# Altium schematic sheet KSZ_Switch_Control.SchDoc
size A4; DrawnBy: Emile Renaud; Revision: V1.0; SheetNumber: 6; SheetTotal: 8
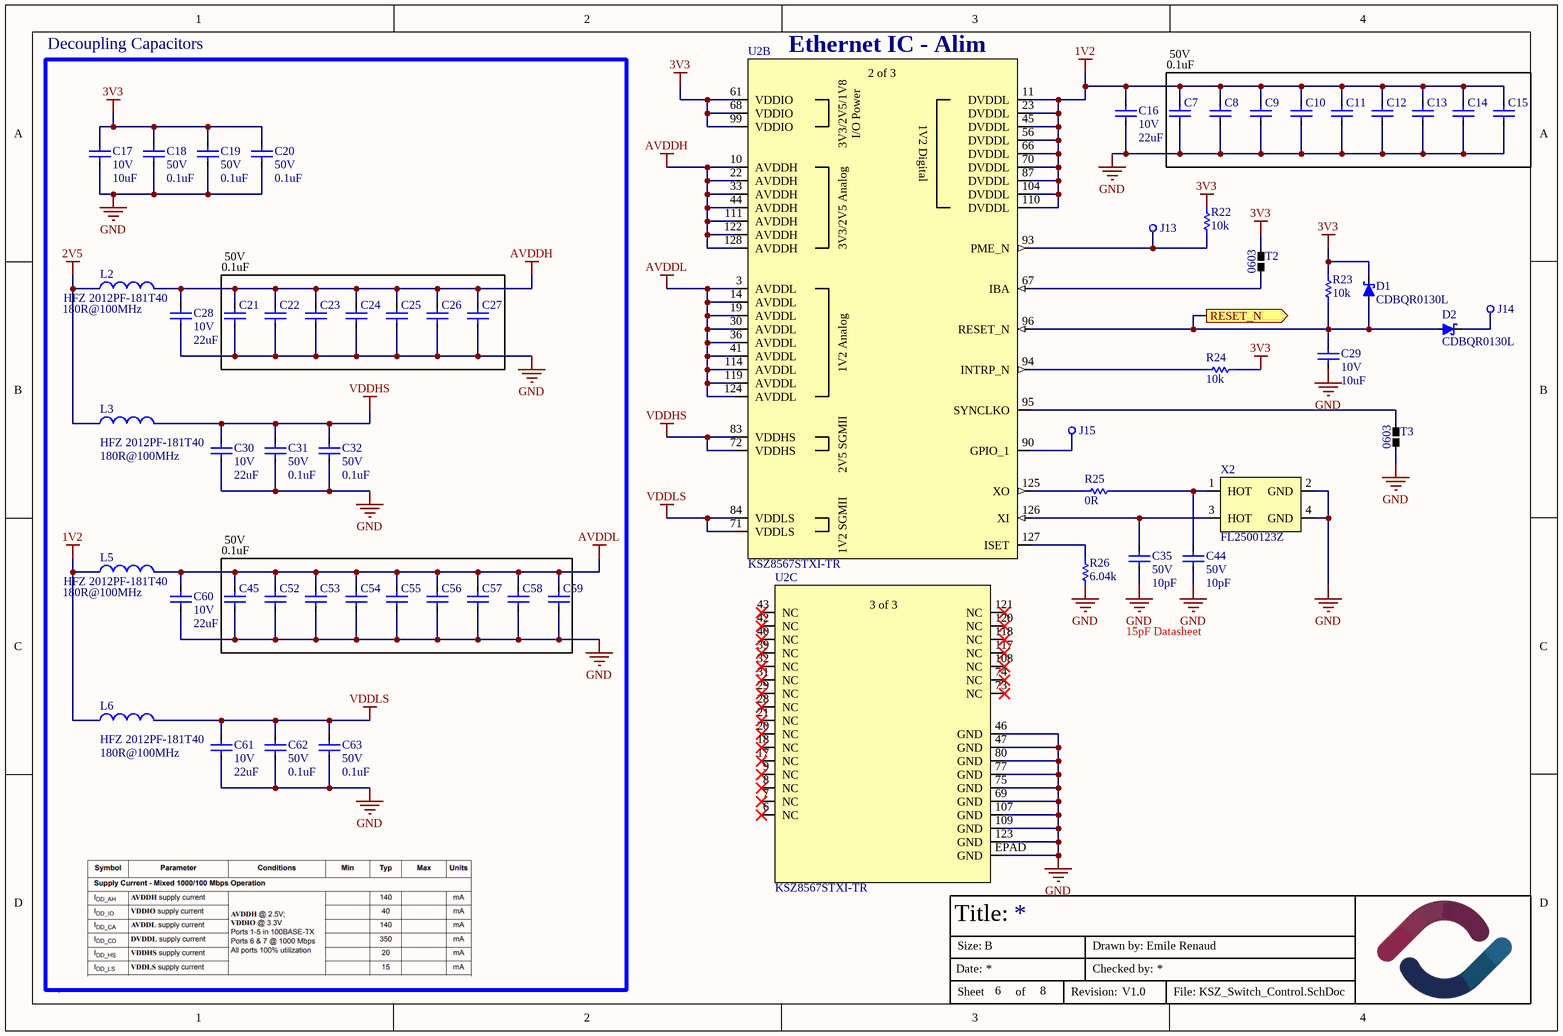
[diagram p0: KSZ_Switch_Control.SchDoc]

## Parts
C7  Capacitor-0603-0.1uF-50V-X7R  [CAPACITOR-0603]  (value not drawn)
C8  Capacitor-0603-0.1uF-50V-X7R  [CAPACITOR-0603]  (value not drawn)
C9  Capacitor-0603-0.1uF-50V-X7R  [CAPACITOR-0603]  (value not drawn)
C10  Capacitor-0603-0.1uF-50V-X7R  [CAPACITOR-0603]  (value not drawn)
C11  Capacitor-0603-0.1uF-50V-X7R  [CAPACITOR-0603]  (value not drawn)
C12  Capacitor-0603-0.1uF-50V-X7R  [CAPACITOR-0603]  (value not drawn)
C13  Capacitor-0603-0.1uF-50V-X7R  [CAPACITOR-0603]  (value not drawn)
C14  Capacitor-0603-0.1uF-50V-X7R  [CAPACITOR-0603]  (value not drawn)
C15  Capacitor-0603-0.1uF-50V-X7R  [CAPACITOR-0603]  (value not drawn)
C16  value 22uF  Volt: 10V  [CAPACITOR-0603]  (hidden comment: Capacitor-0603-22uF-10V-X5R)
C17  value 10uF  Volt: 10V  [CAPACITOR-0603]  (hidden comment: Capacitor-0603-10uF-10V-X5R)
C18  value 0.1uF  Volt: 50V  [CAPACITOR-0603]  (hidden comment: Capacitor-0603-0.1uF-50V-X7R)
C19  value 0.1uF  Volt: 50V  [CAPACITOR-0603]  (hidden comment: Capacitor-0603-0.1uF-50V-X7R)
C20  value 0.1uF  Volt: 50V  [CAPACITOR-0603]  (hidden comment: Capacitor-0603-0.1uF-50V-X7R)
C21  Capacitor-0603-0.1uF-50V-X7R  [CAPACITOR-0603]  (value not drawn)
C22  Capacitor-0603-0.1uF-50V-X7R  [CAPACITOR-0603]  (value not drawn)
C23  Capacitor-0603-0.1uF-50V-X7R  [CAPACITOR-0603]  (value not drawn)
C24  Capacitor-0603-0.1uF-50V-X7R  [CAPACITOR-0603]  (value not drawn)
C25  Capacitor-0603-0.1uF-50V-X7R  [CAPACITOR-0603]  (value not drawn)
C26  Capacitor-0603-0.1uF-50V-X7R  [CAPACITOR-0603]  (value not drawn)
C27  Capacitor-0603-0.1uF-50V-X7R  [CAPACITOR-0603]  (value not drawn)
C28  value 22uF  Volt: 10V  [CAPACITOR-0603]  (hidden comment: Capacitor-0603-22uF-10V-X5R)
C29  value 10uF  Volt: 10V  [CAPACITOR-0603]  (hidden comment: Capacitor-0603-10uF-10V-X5R)
C30  value 22uF  Volt: 10V  [CAPACITOR-0603]  (hidden comment: Capacitor-0603-22uF-10V-X5R)
C31  value 0.1uF  Volt: 50V  [CAPACITOR-0603]  (hidden comment: Capacitor-0603-0.1uF-50V-X7R)
C32  value 0.1uF  Volt: 50V  [CAPACITOR-0603]  (hidden comment: Capacitor-0603-0.1uF-50V-X7R)
C35  value 10pF  Volt: 50V  [CAPACITOR-0402]  (hidden comment: Capacitor-0402-10pF-50V-C0G)
C44  value 10pF  Volt: 50V  [CAPACITOR-0402]  (hidden comment: Capacitor-0402-10pF-50V-C0G)
C45  Capacitor-0603-0.1uF-50V-X7R  [CAPACITOR-0603]  (value not drawn)
C52  Capacitor-0603-0.1uF-50V-X7R  [CAPACITOR-0603]  (value not drawn)
C53  Capacitor-0603-0.1uF-50V-X7R  [CAPACITOR-0603]  (value not drawn)
C54  Capacitor-0603-0.1uF-50V-X7R  [CAPACITOR-0603]  (value not drawn)
C55  Capacitor-0603-0.1uF-50V-X7R  [CAPACITOR-0603]  (value not drawn)
C56  Capacitor-0603-0.1uF-50V-X7R  [CAPACITOR-0603]  (value not drawn)
C57  Capacitor-0603-0.1uF-50V-X7R  [CAPACITOR-0603]  (value not drawn)
C58  Capacitor-0603-0.1uF-50V-X7R  [CAPACITOR-0603]  (value not drawn)
C59  Capacitor-0603-0.1uF-50V-X7R  [CAPACITOR-0603]  (value not drawn)
C60  value 22uF  Volt: 10V  [CAPACITOR-0603]  (hidden comment: Capacitor-0603-22uF-10V-X5R)
C61  value 22uF  Volt: 10V  [CAPACITOR-0603]  (hidden comment: Capacitor-0603-22uF-10V-X5R)
C62  value 0.1uF  Volt: 50V  [CAPACITOR-0603]  (hidden comment: Capacitor-0603-0.1uF-50V-X7R)
C63  value 0.1uF  Volt: 50V  [CAPACITOR-0603]  (hidden comment: Capacitor-0603-0.1uF-50V-X7R)
D1  CDBQR0130L  [Diode-0402]
D2  CDBQR0130L  [Diode-0402]
J13  hole  [PAD-0.53MM]  (value not drawn)  (no BOM)
J14  hole  [PAD-0.53MM]  (value not drawn)  (no BOM)
J15  hole  [PAD-0.53MM]  (value not drawn)  (no BOM)
L2  HFZ 2012PF-181T40  value 180R@100MHz  [CAPACITOR-0805]
L3  HFZ 2012PF-181T40  value 180R@100MHz  [CAPACITOR-0805]
L5  HFZ 2012PF-181T40  value 180R@100MHz  [CAPACITOR-0805]
L6  HFZ 2012PF-181T40  value 180R@100MHz  [CAPACITOR-0805]
R22  value 10k  [Resistor-0603]  (hidden comment: SMT resistor)
R23  value 10k  [Resistor-0603]  (hidden comment: SMT resistor)
R24  value 10k  [Resistor-0603]  (hidden comment: SMT resistor)
R25  value 0R  [Resistor-0402]  (hidden comment: SMT resistor)
R26  value 6.04k  [Resistor-0603]  (hidden comment: SMT resistor)
T2  NetTie_0603  [NetTie-0603-short]  (value not drawn)
T3  NetTie_0603_Short  [NetTie-0603-short]  (value not drawn)
U2  KSZ8567STXI-TR  [TQFP128_EP_6XX_MCH-M]  (parts B,C of 3)
X2  FL2500123Z  [4-SMD]

## Blocks framed on the sheet
Decoupling Capacitors: C17-C28 C30-C32 C45 C52-C63 L2 L3 L5 L6

## Ports
RESET_N (out)

## Nets
1V2: C7.2 C8.2 C9.2 C10.2 C11.2 C12.2 C13.2 C14.2 C15.2 C16.2 L5.1 L6.1 U2.11(DVDDL) U2.23(DVDDL) U2.45(DVDDL) U2.56(DVDDL) U2.66(DVDDL) U2.70(DVDDL) U2.87(DVDDL) U2.104(DVDDL) U2.110(DVDDL)
2V5: L2.1 L3.1
3V3: C17.2 C18.2 C19.2 C20.2 D1.2(K) R22.2 R23.2 R24.2 T2.1 U2.61(VDDIO) U2.68(VDDIO) U2.99(VDDIO)
AVDDH: C21.2 C22.2 C23.2 C24.2 C25.2 C26.2 C27.2 C28.2 L2.2 U2.10(AVDDH) U2.22(AVDDH) U2.33(AVDDH) U2.44(AVDDH) U2.111(AVDDH) U2.122(AVDDH) U2.128(AVDDH)
AVDDL: C45.2 C52.2 C53.2 C54.2 C55.2 C56.2 C57.2 C58.2 C59.2 C60.2 L5.2 U2.3(AVDDL) U2.14(AVDDL) U2.19(AVDDL) U2.30(AVDDL) U2.36(AVDDL) U2.41(AVDDL) U2.114(AVDDL) U2.119(AVDDL) U2.124(AVDDL)
GND: C7.1 C8.1 C9.1 C10.1 C11.1 C12.1 C13.1 C14.1 C15.1 C16.1 C17.1 C18.1 C19.1 C20.1 C21.1 C22.1 C23.1 C24.1 C25.1 C26.1 C27.1 C28.1 C29.1 C30.1 C31.1 C32.1 C35.1 C44.1 C45.1 C52.1 C53.1 C54.1 C55.1 C56.1 C57.1 C58.1 C59.1 C60.1 C61.1 C62.1 C63.1 R26.1 T3.2 U2.46(GND) U2.47(GND) U2.69(GND) U2.75(GND) U2.77(GND) U2.80(GND) U2.107(GND) U2.109(GND) U2.123(GND) U2.EPAD(GND) X2.2(GND) X2.4(GND)
VDDHS: C30.2 C31.2 C32.2 L3.2 U2.72(VDDHS) U2.83(VDDHS)
VDDLS: C61.2 C62.2 C63.2 L6.2 U2.71(VDDLS) U2.84(VDDLS)
RESET_N: C29.2 D1.1(A) D2.1(A) R23.1 U2.96(RESET_N) ; port RESET_N
NetC35_2: C35.2 U2.126(XI) X2.3(HOT)
NetC44_2: C44.2 R25.2 X2.1(HOT)
NetD2_2: D2.2(K) J14.1
NetJ13_1: J13.1 R22.1 U2.93(PME_N)
NetJ15_1: J15.1 U2.90(GPIO_1)
NetR24_1: R24.1 U2.94(INTRP_N)
NetR25_1: R25.1 U2.125(XO)
NetR26_2: R26.2 U2.127(ISET)
NetT2_2: T2.2 U2.67(IBA)
NetT3_1: T3.1 U2.95(SYNCLKO)

Not connected (* = marked no-connect by the designer): U2 6(NC)* 7(NC)* 8(NC)* 9(NC)* 17(NC)* 18(NC)* 20(NC)* 21(NC)* 28(NC)* 29(NC)* 31(NC)* 32(NC)* 39(NC)* 40(NC)* 42(NC)* 43(NC)* 73(NC)* 74(NC)* 108(NC)* 117(NC)* 118(NC)* 120(NC)* 121(NC)*

## Notes on the sheet
- (near U2) Ethernet IC - Alim
- 0.1uF
- 50V
- 15pF Datasheet
- Title:
- Date:
- Size:
- B
- Drawn by:
- Checked by:
- Sheet
- of
- Revision:
- File:
- (in symbol KSZ8567STXI-TR, part B) 2 of 3; 3V3/2V5/1V8; I/O Power; 1V2 Digital; 3V3/2V5 Analog; 1V2 Analog; 2V5 SGMII; 1V2 SGMII
- (in symbol KSZ8567STXI-TR, part C) 3 of 3
- (in symbol NetTie_0603_Short) 0603

## Library data of the parts
C7-C15 C21-C27 C45 C52-C59 = Capacitor-0603-0.1uF-50V-X7R: Precision: X7R-10%; Volt: 50V; Value: 0.1uF; Package / Case: Metric 1608, EIA 0603; Mounted: Yes; Supplier 1: Digi-Key; Supplier Part Number 1: 1276-1935-2-ND; Supplier 2: Digi-Key; Supplier Part Number 2: 1276-1934-2-ND
C16 C28 C30 C60 C61 = Capacitor-0603-22uF-10V-X5R: Precision: 20%; Supplier 1: Digikey; Supplier Part Number 1: 1276-1274-1-ND; Mounted: Yes; Package / Case: Metric 1608 , EIA 0603
C17 C29 = Capacitor-0603-10uF-10V-X5R: 10 µF ±20% 10V Ceramic Capacitor X5R 0603 (1608 Metric); Supplier 1: Digikey; Supplier Part Number 1: 4713-GMC10X5R106M10NTCT-ND; Mounted: Yes; Package / Case: Metric 1608 , EIA 0603; Precision: 20%
C18-C20 C31 C32 C62 C63 = Capacitor-0603-0.1uF-50V-X7R: Precision: X7R-10%; Package / Case: Metric 1608, EIA 0603; Mounted: Yes; Supplier 1: Digi-Key; Supplier Part Number 1: 1276-1935-2-ND; Supplier 2: Digi-Key; Supplier Part Number 2: 1276-1934-2-ND
C35 C44 = Capacitor-0402-10pF-50V-C0G: Precision: C0G - 10%; Package / Case: 0402 (1005 Metric); Mounted: Yes; Supplier 1: Digi-Key; Supplier Part Number 1: 399-C0402C100K5GAC7867CT-ND; Supplier 2: Digi-Key; HelpURL: https://connect.kemet.com:7667/gateway/IntelliData-ComponentDocumentation/1.0/download/datasheet/C0402C100K5GACTU
D1 D2 = CDBQR0130L: Diode SCHOTTKY  30 V 100mA Surface Mount 0402/SOD-923F; Volt: 30; Supplier 1: Digi-Key; Supplier Part Number 1: 641-1271-1-ND; Mounted: Yes; Package / Case: 0402/SOD-923F
J13-J15 = PAD 0.53mm AWG28-Solid: PAD for 28 AWG Solid Wire; Mounted: N/A
L2 L3 L5 L6 = HFZ 2012PF-181T40: 180 Ohms @ 100 MHz 1 Power Line Ferrite Bead 0805 (2012 Metric) 4A 20mOhm; Supplier 1: Digi-Key; Mounted: Yes; Supplier Part Number 1: 4816-HFZ2012PF-181T40CT-ND; Package / Case: SMD; Current: 4A
R22-R24 = Resistor-0603-10k: Resistor0603-10k; Precision: 1%; Watt: 0.1W; Mounted: Yes; Package / Case: Metric 1608, EIA 0603; Supplier 1: Digi-Key; Supplier Part Number 1: 311-10.0KHRTR-ND
R25 = Resistor-0402-0R: Precision: 1%; Watt: 1/16W; Mounted: Yes; Package / Case: Metric 1005, EIA 0402; Supplier 1: Digi-Key; Supplier Part Number 1: 311-100LRCT-ND
R26 = Resistor-0603-6.04k: Precision: 1%; Watt: 0.1W; Mounted: Yes; Package / Case: Metric 1608, EIA 0603; Supplier 1: Digi-Key; Supplier Part Number 1: 311-6.04KHRCT-ND
T2 = NetTie_0603_Short
U2 = KSZ8567STXI-TR: IC ETHERNET SWITCH 7PORT 128TQFP; Package / Case: 128TQFP; Mounted: Yes; Supplier 1: Digikey; Supplier Part Number 1: KSZ8567STXI-CT-ND; HelpURL: https://ww1.microchip.com/downloads/aemDocuments/documents/OTH/ProductDocuments/DataSheets/KSZ8567S-Data-Sheet-DS00002391C.pdf
X2 = FL2500123Z: 25 MHz ±30ppm Crystal 20pF 50 Ohms 4-SMD, No Lead; Supplier 1: Digikey; Supplier Part Number 1: FL2500123ZCT-ND; HelpURL: https://www.diodes.com/assets/Datasheets/FL.pdf